# Altium project LogicBoard.PrjPcb
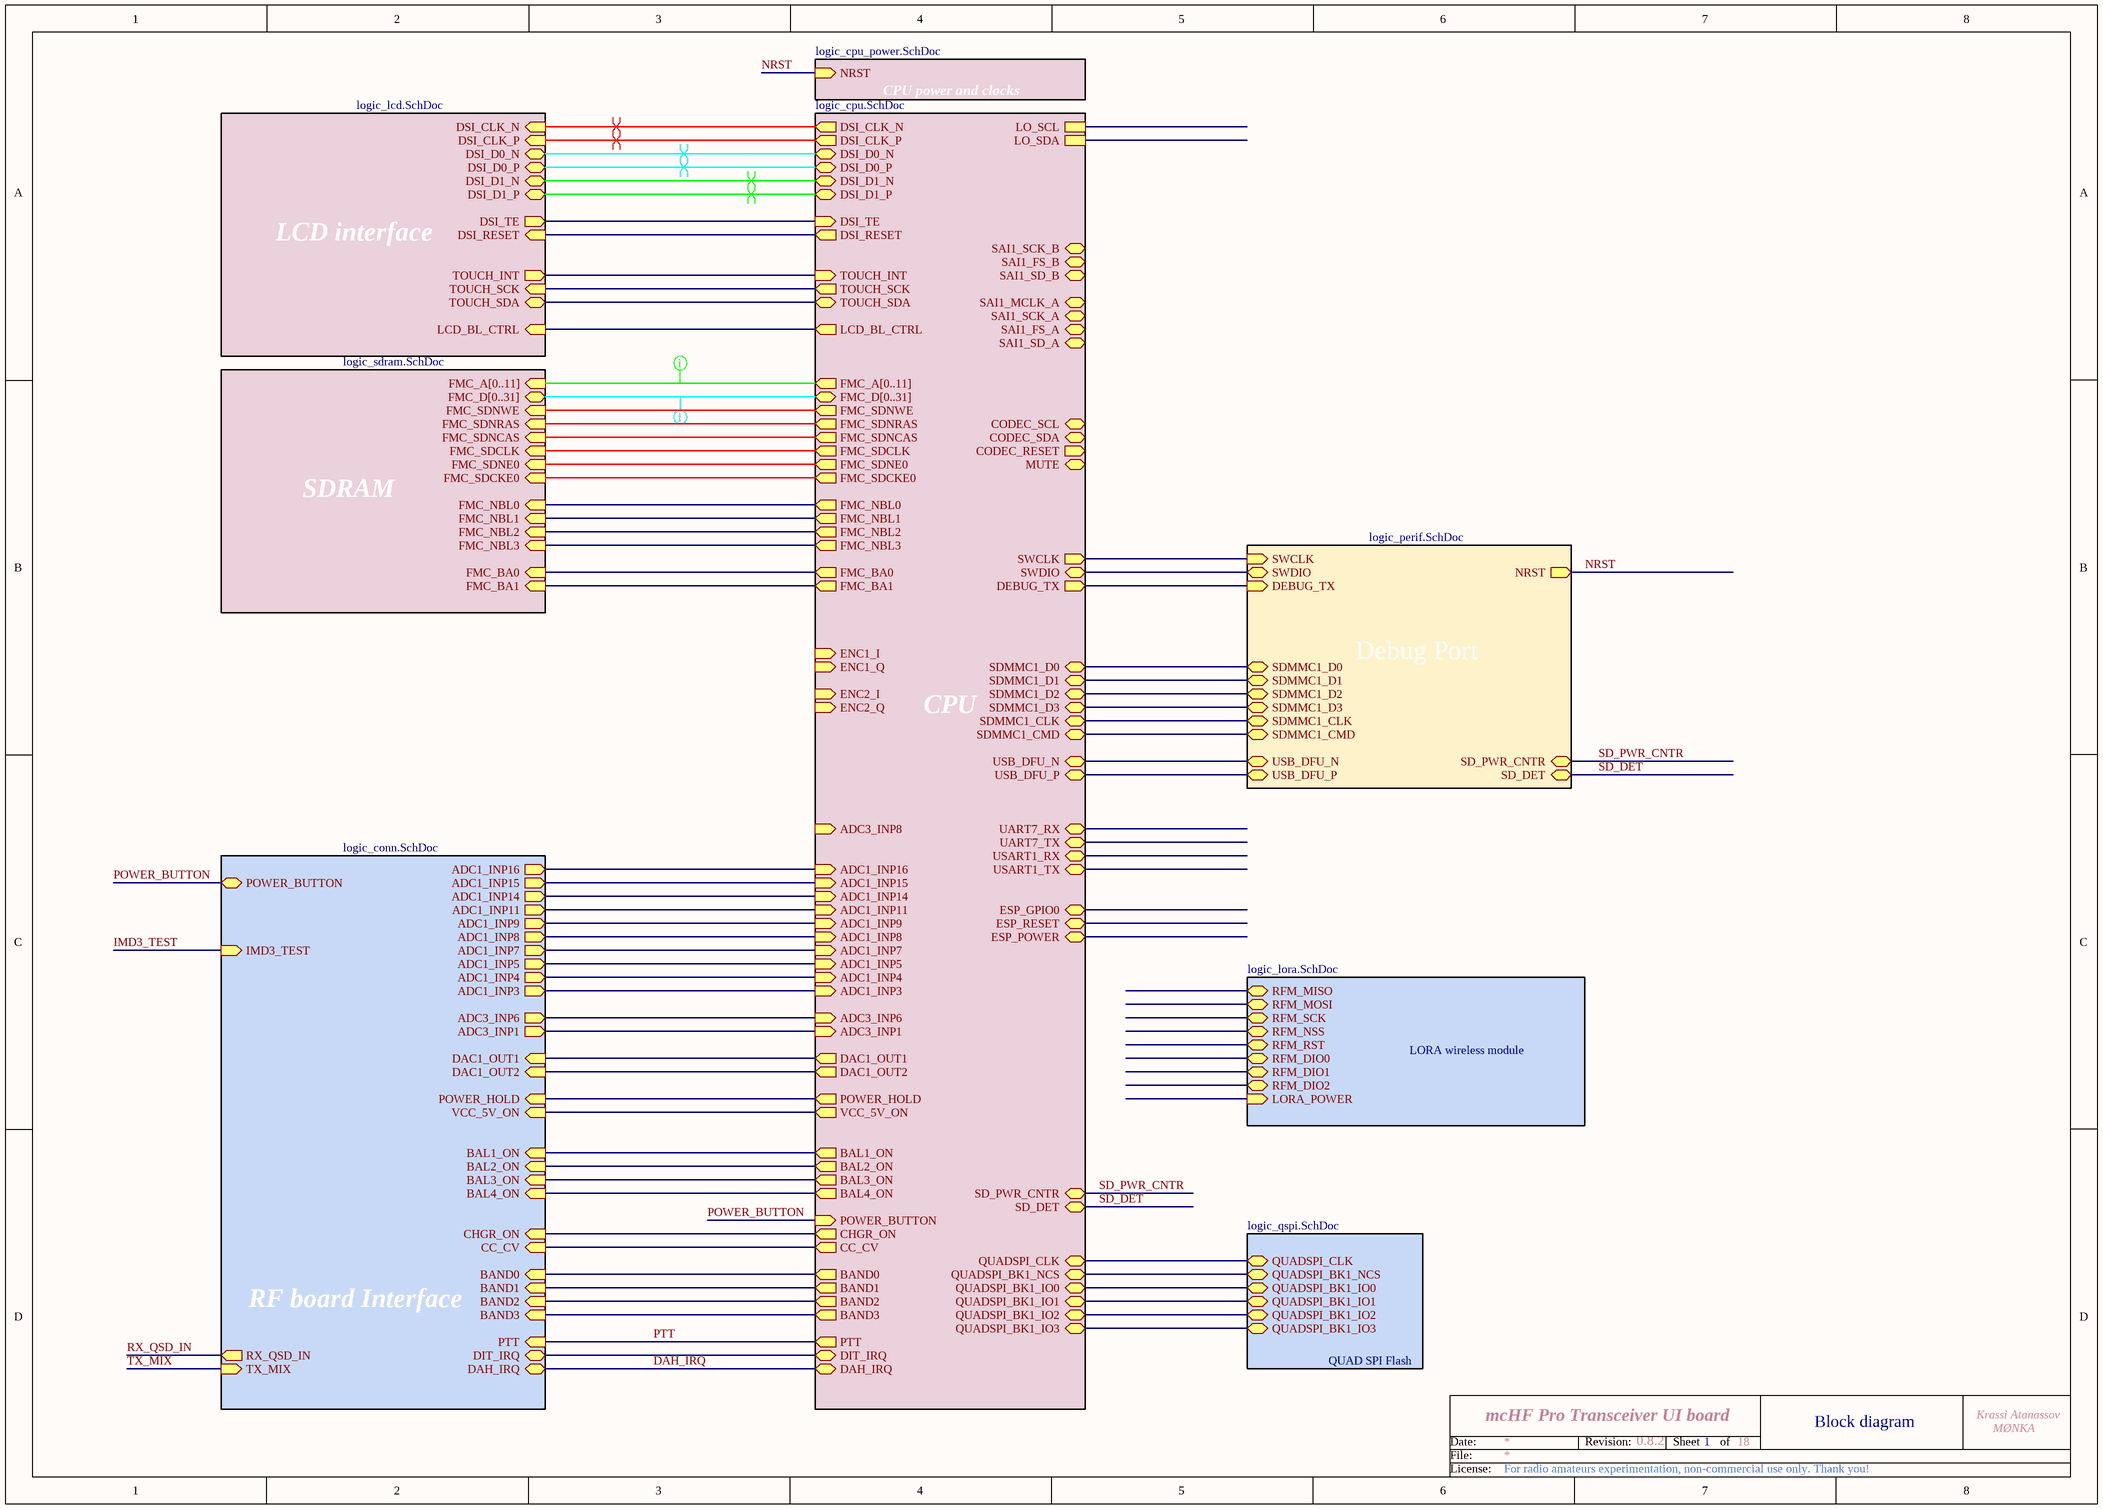
[diagram p0: logic_main.SchDoc]
4 sheets, 120 parts. Net scope: hierarchical (ports join the sheet entries above them; power ports are global).
Sheets:
  logic_main.SchDoc
    RF board Interface = logic_conn.SchDoc
    SDRAM = logic_sdram.SchDoc
    CPU power and clocks = logic_cpu_power.SchDoc

## Sheet logic_main.SchDoc: mcHF Pro Transceiver UI board
size A3; Author: Krassi Atanassov; CompanyName: MØNKA; Engineer: For radio amateurs experimentation, non-commercial use only. Thank you!; Revision: 0.8.2; SheetTotal: 18

### Sub-sheets
CPU = logic_cpu.SchDoc (file not in this document): FMC_A[0..11] (out), FMC_D[0..31] (bidir), FMC_SDNWE (out), FMC_SDNRAS (out), FMC_SDNCAS (out), FMC_SDCLK (out), FMC_BA0 (out), FMC_BA1 (out), FMC_SDNE0 (out), FMC_SDCKE0 (out), FMC_NBL0 (out), FMC_NBL1 (out), ENC1_I (in), ENC1_Q (in), ENC2_I (in), ENC2_Q (in), FMC_NBL2 (out), FMC_NBL3 (out), SWCLK (out), SWDIO (bidir), SDMMC1_D0 (bidir), SDMMC1_D1 (bidir), SDMMC1_D2 (bidir), SDMMC1_D3 (bidir), SDMMC1_CLK (bidir), SDMMC1_CMD (bidir), UART7_RX (bidir), UART7_TX (bidir), ESP_GPIO0 (bidir), ESP_RESET (bidir), ESP_POWER (bidir), DSI_CLK_N (out), DSI_CLK_P (out), DSI_D0_N (bidir), DSI_D0_P (bidir), DSI_D1_N (bidir), DSI_D1_P (bidir), LCD_BL_CTRL (out), TOUCH_INT (in), TOUCH_SCK (out), TOUCH_SDA (bidir), DSI_TE (in), DSI_RESET (out), LO_SCL, LO_SDA, ADC1_INP15 (in), ADC1_INP11 (in), ADC1_INP14 (in), ADC1_INP9 (in), ADC1_INP8 (in), ADC1_INP7 (in), ADC1_INP5 (in), ADC1_INP4 (in), ADC3_INP6 (in), ADC1_INP3 (in), ADC3_INP1 (in), POWER_HOLD (out), DAC1_OUT1 (out), DAC1_OUT2 (out), ADC1_INP16 (in), CODEC_SCL (bidir), CODEC_SDA (bidir), SAI1_SCK_B (bidir), SAI1_FS_B (bidir), SAI1_SD_B (bidir), SAI1_MCLK_A (bidir), SAI1_SCK_A (bidir), SAI1_FS_A (bidir), SAI1_SD_A (bidir), QUADSPI_CLK (bidir), QUADSPI_BK1_NCS (bidir), QUADSPI_BK1_IO0 (bidir), QUADSPI_BK1_IO1 (bidir), QUADSPI_BK1_IO3 (bidir), QUADSPI_BK1_IO2 (bidir), USART1_RX (bidir), USART1_TX (bidir), DEBUG_TX (out), VCC_5V_ON (out), BAL1_ON (out), BAL2_ON (out), BAL3_ON (out), BAND0 (out), BAND1 (out), BAND2 (out), BAND3 (out), PTT (out), DIT_IRQ (bidir), DAH_IRQ (bidir), ADC3_INP8 (in), USB_DFU_N (bidir), USB_DFU_P (bidir), CODEC_RESET (out), POWER_BUTTON (in), MUTE (bidir), BAL4_ON (out), CHGR_ON (out), CC_CV (out), SD_DET (bidir), SD_PWR_CNTR (bidir)
CPU power and clocks = logic_cpu_power.SchDoc: NRST (in)
Debug Port = logic_perif.SchDoc (file not in this document): SWCLK (in), SWDIO (bidir), NRST (out), SD_PWR_CNTR (bidir), SD_DET (bidir), DEBUG_TX (in), USB_DFU_N (bidir), USB_DFU_P (bidir), SDMMC1_D0 (bidir), SDMMC1_D1 (bidir), SDMMC1_D2 (bidir), SDMMC1_D3 (bidir), SDMMC1_CLK (bidir), SDMMC1_CMD (bidir)
LCD interface = logic_lcd.SchDoc (file not in this document): DSI_CLK_N (in), LCD_BL_CTRL (in), TOUCH_INT (out), TOUCH_SCK (in), TOUCH_SDA (bidir), DSI_CLK_P (in), DSI_D0_N (bidir), DSI_D0_P (bidir), DSI_D1_N (bidir), DSI_D1_P (bidir), DSI_TE (out), DSI_RESET (in)
LORA wireless module = logic_lora.SchDoc (file not in this document): RFM_MISO (bidir), RFM_MOSI (bidir), RFM_SCK (bidir), RFM_NSS (bidir), RFM_RST (bidir), RFM_DIO0 (bidir), LORA_POWER (in), RFM_DIO1 (bidir), RFM_DIO2 (bidir)
QUAD SPI Flash = logic_qspi.SchDoc (file not in this document): QUADSPI_CLK (bidir), QUADSPI_BK1_NCS (bidir), QUADSPI_BK1_IO0 (bidir), QUADSPI_BK1_IO1 (bidir), QUADSPI_BK1_IO3 (bidir), QUADSPI_BK1_IO2 (bidir)
RF board Interface = logic_conn.SchDoc: RX_QSD_IN (out), TX_MIX (in), ADC3_INP6 (out), ADC3_INP1 (out), POWER_HOLD (in), POWER_BUTTON (bidir), DAC1_OUT1 (in), DAC1_OUT2 (in), ADC1_INP15 (out), ADC1_INP11 (out), ADC1_INP14 (out), ADC1_INP9 (out), ADC1_INP8 (out), ADC1_INP7 (out), ADC1_INP5 (out), ADC1_INP4 (out), ADC1_INP3 (out), ADC1_INP16 (out), VCC_5V_ON (in), BAL1_ON (in), BAL2_ON (in), BAL3_ON (in), CHGR_ON (in), CC_CV (in), BAND0 (in), BAND1 (in), BAND2 (in), BAND3 (in), PTT (in), DIT_IRQ (bidir), DAH_IRQ (bidir), IMD3_TEST (in), BAL4_ON (in)
SDRAM = logic_sdram.SchDoc: FMC_A[0..11] (in), FMC_D[0..31] (bidir), FMC_SDNWE (in), FMC_SDNRAS (in), FMC_SDNCAS (in), FMC_SDCLK (in), FMC_BA0 (in), FMC_BA1 (in), FMC_NBL0 (in), FMC_NBL1 (in), FMC_SDNE0 (in), FMC_SDCKE0 (in), FMC_NBL2 (in), FMC_NBL3 (in)

### Nets
ADC1_INP3: sheet RF board Interface/ADC1_INP3, sheet CPU/ADC1_INP3
ADC1_INP4: sheet RF board Interface/ADC1_INP4, sheet CPU/ADC1_INP4
ADC1_INP5: sheet RF board Interface/ADC1_INP5, sheet CPU/ADC1_INP5
ADC1_INP7: sheet RF board Interface/ADC1_INP7, sheet CPU/ADC1_INP7
ADC1_INP8: sheet RF board Interface/ADC1_INP8, sheet CPU/ADC1_INP8
ADC1_INP9: sheet RF board Interface/ADC1_INP9, sheet CPU/ADC1_INP9
ADC1_INP11: sheet RF board Interface/ADC1_INP11, sheet CPU/ADC1_INP11
ADC1_INP14: sheet RF board Interface/ADC1_INP14, sheet CPU/ADC1_INP14
ADC1_INP15: sheet RF board Interface/ADC1_INP15, sheet CPU/ADC1_INP15
ADC1_INP16: sheet RF board Interface/ADC1_INP16, sheet CPU/ADC1_INP16
ADC3_INP1: sheet RF board Interface/ADC3_INP1, sheet CPU/ADC3_INP1
ADC3_INP6: sheet RF board Interface/ADC3_INP6, sheet CPU/ADC3_INP6
BAL1_ON: sheet RF board Interface/BAL1_ON, sheet CPU/BAL1_ON
BAL2_ON: sheet RF board Interface/BAL2_ON, sheet CPU/BAL2_ON
BAL3_ON: sheet RF board Interface/BAL3_ON, sheet CPU/BAL3_ON
BAL4_ON: sheet RF board Interface/BAL4_ON, sheet CPU/BAL4_ON
BAND0: sheet RF board Interface/BAND0, sheet CPU/BAND0
BAND1: sheet RF board Interface/BAND1, sheet CPU/BAND1
BAND2: sheet RF board Interface/BAND2, sheet CPU/BAND2
BAND3: sheet RF board Interface/BAND3, sheet CPU/BAND3
CC_CV: sheet RF board Interface/CC_CV, sheet CPU/CC_CV
CHGR_ON: sheet RF board Interface/CHGR_ON, sheet CPU/CHGR_ON
DAC1_OUT1: sheet RF board Interface/DAC1_OUT1, sheet CPU/DAC1_OUT1
DAC1_OUT2: sheet RF board Interface/DAC1_OUT2, sheet CPU/DAC1_OUT2
DAH_IRQ: sheet RF board Interface/DAH_IRQ, sheet CPU/DAH_IRQ
DIT_IRQ: sheet RF board Interface/DIT_IRQ, sheet CPU/DIT_IRQ
FMC_BA0: sheet CPU/FMC_BA0, sheet SDRAM/FMC_BA0
FMC_BA1: sheet CPU/FMC_BA1, sheet SDRAM/FMC_BA1
FMC_NBL0: sheet CPU/FMC_NBL0, sheet SDRAM/FMC_NBL0
FMC_NBL1: sheet CPU/FMC_NBL1, sheet SDRAM/FMC_NBL1
FMC_NBL2: sheet CPU/FMC_NBL2, sheet SDRAM/FMC_NBL2
FMC_NBL3: sheet CPU/FMC_NBL3, sheet SDRAM/FMC_NBL3
FMC_SDCKE0: sheet CPU/FMC_SDCKE0, sheet SDRAM/FMC_SDCKE0
FMC_SDCLK: sheet CPU/FMC_SDCLK, sheet SDRAM/FMC_SDCLK
FMC_SDNCAS: sheet CPU/FMC_SDNCAS, sheet SDRAM/FMC_SDNCAS
FMC_SDNE0: sheet CPU/FMC_SDNE0, sheet SDRAM/FMC_SDNE0
FMC_SDNRAS: sheet CPU/FMC_SDNRAS, sheet SDRAM/FMC_SDNRAS
FMC_SDNWE: sheet CPU/FMC_SDNWE, sheet SDRAM/FMC_SDNWE
NRST: sheet CPU power and clocks/NRST, sheet Debug Port/NRST
POWER_BUTTON: sheet RF board Interface/POWER_BUTTON, sheet CPU/POWER_BUTTON
PTT: sheet RF board Interface/PTT, sheet CPU/PTT
SD_DET: sheet CPU/SD_DET, sheet Debug Port/SD_DET
SD_PWR_CNTR: sheet CPU/SD_PWR_CNTR, sheet Debug Port/SD_PWR_CNTR
VCC_5V_ON: sheet RF board Interface/VCC_5V_ON, sheet CPU/VCC_5V_ON
NetD2_1: sheet RF board Interface/POWER_HOLD, sheet CPU/POWER_HOLD
(unnamed): sheet CPU/SWCLK, sheet Debug Port/SWCLK
(unnamed): sheet CPU/SWDIO, sheet Debug Port/SWDIO
(unnamed): sheet CPU/SDMMC1_D0, sheet Debug Port/SDMMC1_D0
(unnamed): sheet CPU/SDMMC1_D1, sheet Debug Port/SDMMC1_D1
(unnamed): sheet CPU/SDMMC1_D2, sheet Debug Port/SDMMC1_D2
(unnamed): sheet CPU/SDMMC1_D3, sheet Debug Port/SDMMC1_D3
(unnamed): sheet CPU/SDMMC1_CLK, sheet Debug Port/SDMMC1_CLK
(unnamed): sheet CPU/SDMMC1_CMD, sheet Debug Port/SDMMC1_CMD
(unnamed): sheet CPU/DSI_CLK_N, sheet LCD interface/DSI_CLK_N
(unnamed): sheet CPU/DSI_CLK_P, sheet LCD interface/DSI_CLK_P
(unnamed): sheet CPU/DSI_D0_N, sheet LCD interface/DSI_D0_N
(unnamed): sheet CPU/DSI_D0_P, sheet LCD interface/DSI_D0_P
(unnamed): sheet CPU/DSI_D1_N, sheet LCD interface/DSI_D1_N
(unnamed): sheet CPU/DSI_D1_P, sheet LCD interface/DSI_D1_P
(unnamed): sheet CPU/LCD_BL_CTRL, sheet LCD interface/LCD_BL_CTRL
(unnamed): sheet CPU/TOUCH_INT, sheet LCD interface/TOUCH_INT
(unnamed): sheet CPU/TOUCH_SCK, sheet LCD interface/TOUCH_SCK
(unnamed): sheet CPU/TOUCH_SDA, sheet LCD interface/TOUCH_SDA
(unnamed): sheet CPU/DSI_TE, sheet LCD interface/DSI_TE
(unnamed): sheet CPU/DSI_RESET, sheet LCD interface/DSI_RESET
(unnamed): sheet CPU/QUADSPI_CLK, sheet QUAD SPI Flash/QUADSPI_CLK
(unnamed): sheet CPU/QUADSPI_BK1_NCS, sheet QUAD SPI Flash/QUADSPI_BK1_NCS
(unnamed): sheet CPU/QUADSPI_BK1_IO0, sheet QUAD SPI Flash/QUADSPI_BK1_IO0
(unnamed): sheet CPU/QUADSPI_BK1_IO1, sheet QUAD SPI Flash/QUADSPI_BK1_IO1
(unnamed): sheet CPU/QUADSPI_BK1_IO3, sheet QUAD SPI Flash/QUADSPI_BK1_IO3
(unnamed): sheet CPU/QUADSPI_BK1_IO2, sheet QUAD SPI Flash/QUADSPI_BK1_IO2
(unnamed): sheet CPU/DEBUG_TX, sheet Debug Port/DEBUG_TX
(unnamed): sheet CPU/USB_DFU_N, sheet Debug Port/USB_DFU_N
(unnamed): sheet CPU/USB_DFU_P, sheet Debug Port/USB_DFU_P

### Buses and harness runs
bus sheet CPU/FMC_A[0..11] = sheet SDRAM/FMC_A[0..11]
bus sheet CPU/FMC_D[0..31] = sheet SDRAM/FMC_D[0..31]

### Layout directives
differential pair: (no net found under the mark)
rule Matched Net Lengths [Tolerance = 100mil]: (no net found under the mark)

### Notes on the sheet
- 1
- Block diagram
- Date:
- File:
- Revision:
- Sheet
- of
- License:

## Sheet logic_conn.SchDoc: mcHF Pro Transceiver UI board
size A3; Author: Krassi Atanassov; CompanyName: MØNKA; Engineer: For radio amateurs experimentation, non-commercial use only. Thank you!; Revision: 0.8.2; SheetTotal: 18
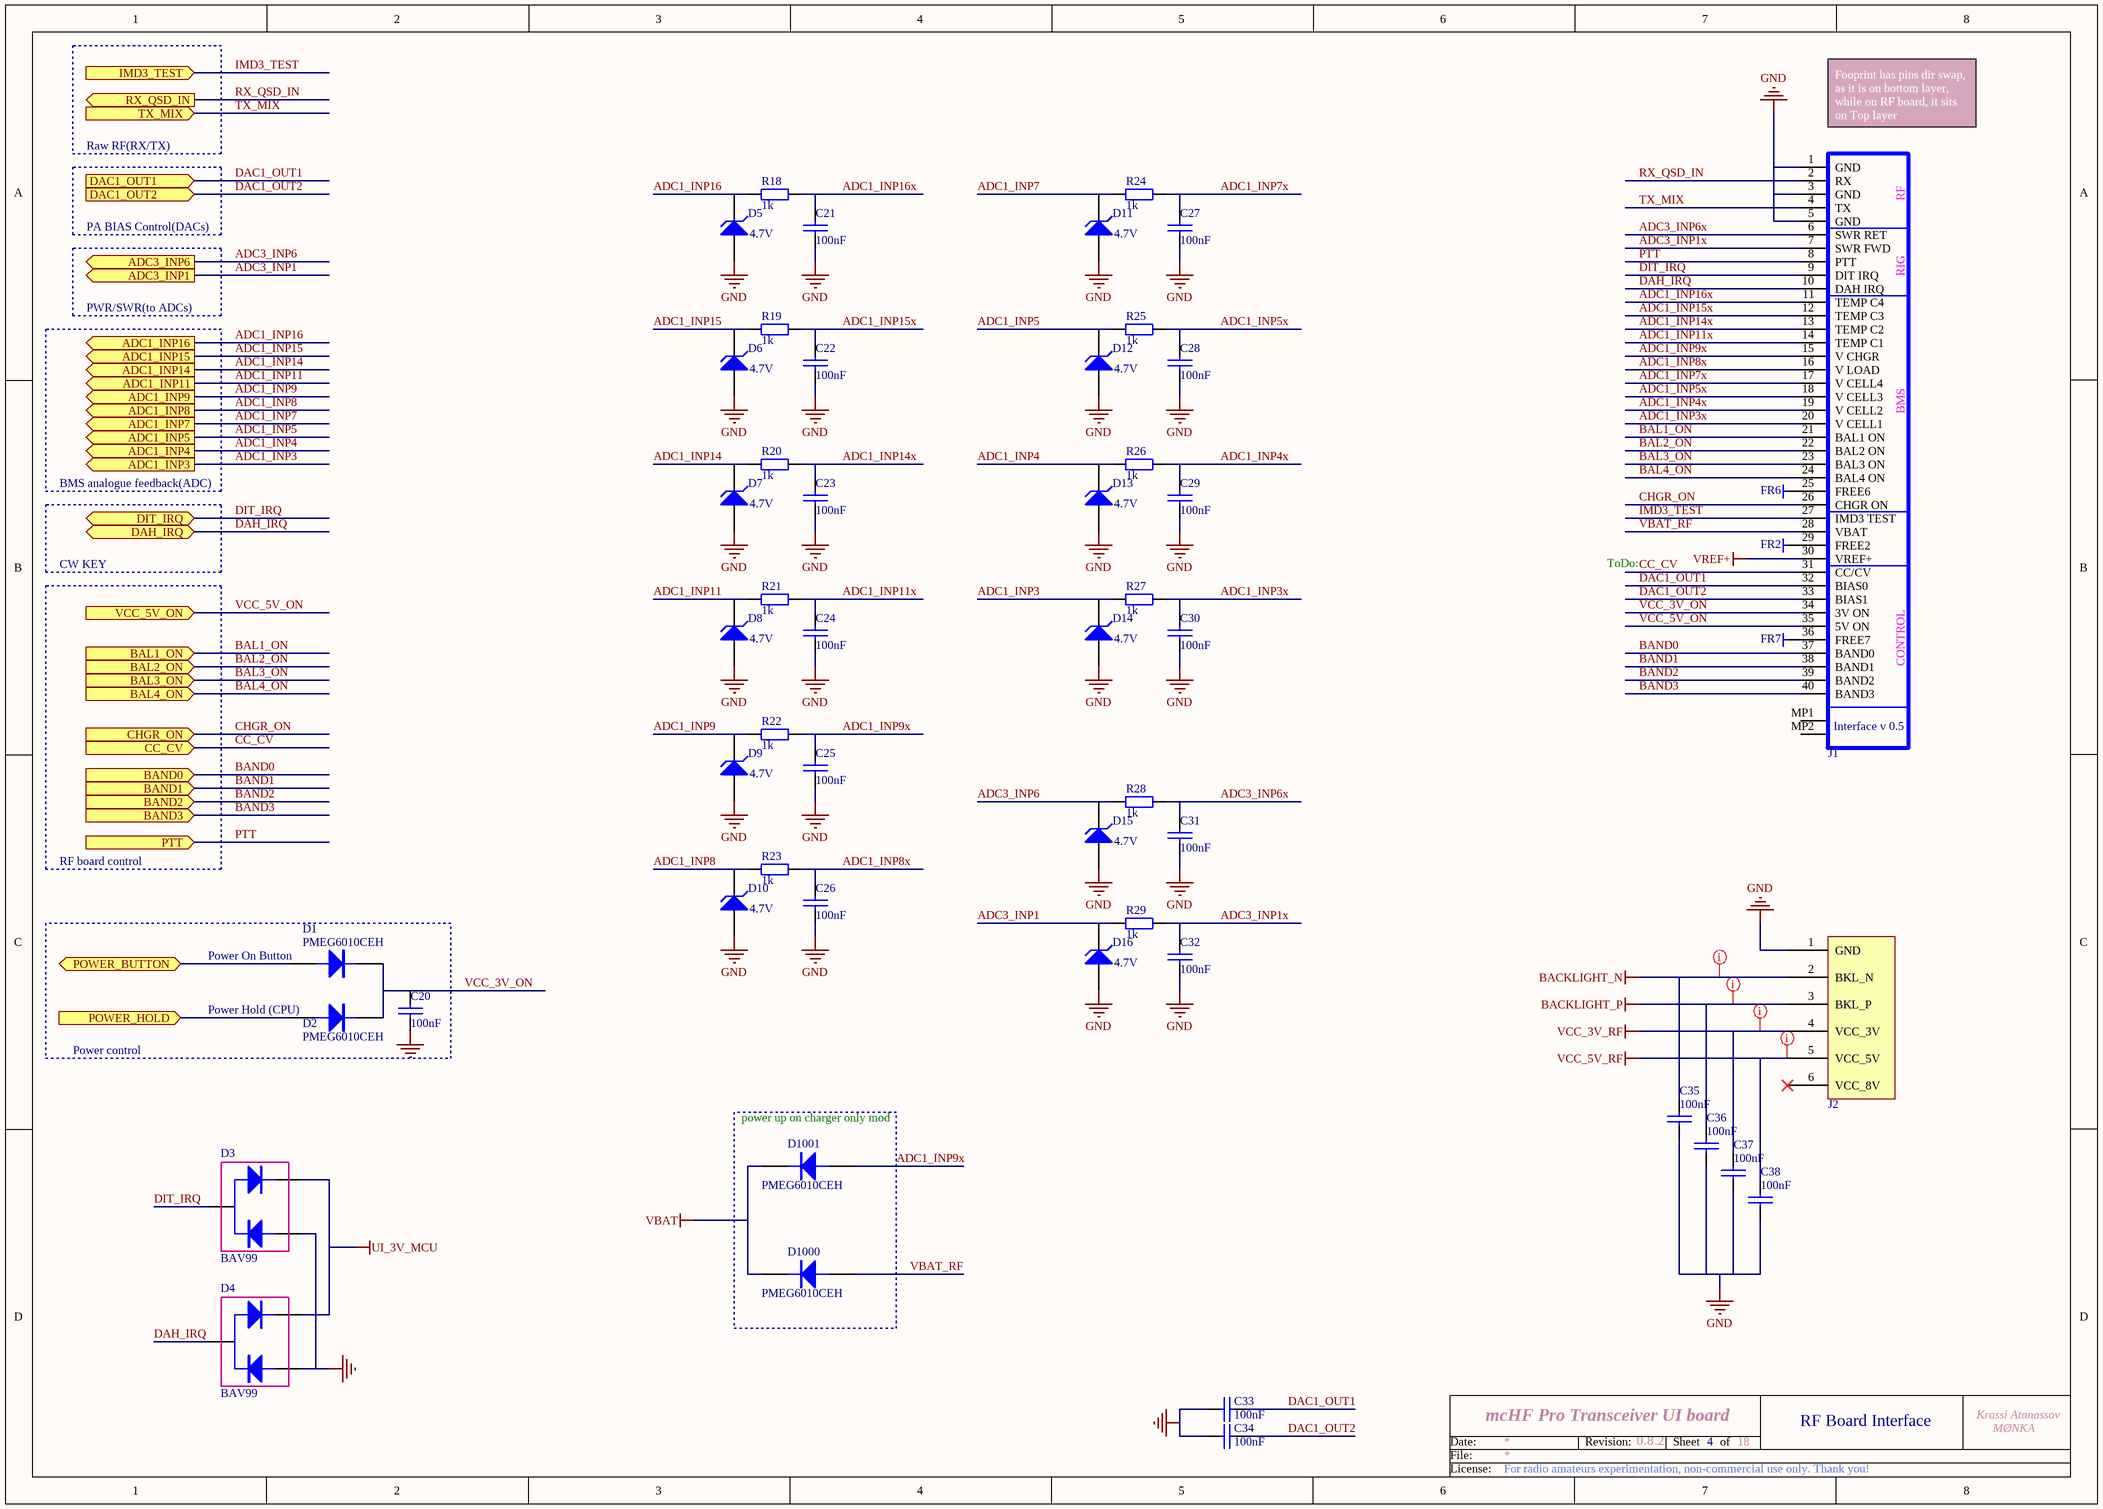
[diagram p1: logic_conn.SchDoc]

### Parts
C20  100nF  [0805]
C21  100nF  [0805]
C22  100nF  [0805]
C23  100nF  [0805]
C24  100nF  [0805]
C25  100nF  [0805]
C26  100nF  [0805]
C27  100nF  [0805]
C28  100nF  [0805]
C29  100nF  [0805]
C30  100nF  [0805]
C31  100nF  [0805]
C32  100nF  [0805]
C33  100nF  [0805]
C34  100nF  [0805]
C35  100nF  [0805]
C36  100nF  [0805]
C37  100nF  [0805]
C38  100nF  [0805]
D1  PMEG6010CEH  [SOD87]
D2  PMEG6010CEH  [SOD87]
D3  BAV99  [SOT-23]
D4  BAV99  [SOT-23]
D5  4.7V  [0805P]
D6  4.7V  [0805P]
D7  4.7V  [0805P]
D8  4.7V  [0805P]
D9  4.7V  [0805P]
D10  4.7V  [0805P]
D11  4.7V  [0805P]
D12  4.7V  [0805P]
D13  4.7V  [0805P]
D14  4.7V  [0805P]
D15  4.7V  [0805P]
D16  4.7V  [0805P]
D1000  PMEG6010CEH  [SOD87]
D1001  PMEG6010CEH  [SOD87]
FR2  TP  [tp]  (value not drawn)  (no BOM)
FR6  TP  [tp]  (value not drawn)  (no BOM)
FR7  TP  [tp]  (value not drawn)  (no BOM)
J1  INT V 0.5  [MOLX-54132-4033r]  (value not drawn)
J2  PWR6  [HDR_1x6_PWR_R]  (value not drawn)
R18  1k  [0805]
R19  1k  [0805]
R20  1k  [0805]
R21  1k  [0805]
R22  1k  [0805]
R23  1k  [0805]
R24  1k  [0805]
R25  1k  [0805]
R26  1k  [0805]
R27  1k  [0805]
R28  1k  [0805]
R29  1k  [0805]

### Blocks framed on the sheet
power up on charger only mod: D1000 D1001

### Ports
ADC1_INP3 (out), ADC1_INP4 (out), ADC1_INP5 (out), ADC1_INP7 (out), ADC1_INP8 (out), ADC1_INP9 (out), ADC1_INP11 (out), ADC1_INP14 (out), ADC1_INP15 (out), ADC1_INP16 (out), ADC3_INP1 (out), ADC3_INP6 (out), BAL1_ON (in), BAL2_ON (in), BAL3_ON (in), BAL4_ON (in), BAND0 (in), BAND1 (in), BAND2 (in), BAND3 (in), CC_CV (in), CHGR_ON (in), DAC1_OUT1 (in), DAC1_OUT2 (in), DAH_IRQ (bidir), DIT_IRQ (bidir), IMD3_TEST (in), POWER_BUTTON (bidir), POWER_HOLD (in), PTT (in), RX_QSD_IN (out), TX_MIX (in), VCC_5V_ON (in)

### Nets
BACKLIGHT_N: C35.2 J2.2(BKL_N)
BACKLIGHT_P: C36.2 J2.3(BKL_P)
GND: C20.1 C21.1 C22.1 C23.1 C24.1 C25.1 C26.1 C27.1 C28.1 C29.1 C30.1 C31.1 C32.1 C33.2 C34.2 C35.1 C36.1 C37.1 C38.1 D3.1(A1) D4.1(A1) D5.1(A) D6.1(A) D7.1(A) D8.1(A) D9.1(A) D10.1(A) D11.1(A) D12.1(A) D13.1(A) D14.1(A) D15.1(A) D16.1(A) J1.1(GND) J1.3(GND) J1.5(GND) J2.1(GND)
UI_3V_MCU: D3.2(K1) D4.2(K1)
VBAT: D1000.2(K) D1001.2(K)
VCC_3V_RF: C37.2 J2.4(VCC_3V)
VCC_5V_RF: C38.2 J2.5(VCC_5V)
VREF+: J1.30(VREF+)
ADC1_INP3: D14.2(K) R27.2 ; port ADC1_INP3
ADC1_INP3x: C30.2 J1.20(V_CELL1) R27.1
ADC1_INP4: D13.2(K) R26.2 ; port ADC1_INP4
ADC1_INP4x: C29.2 J1.19(V_CELL2) R26.1
ADC1_INP5: D12.2(K) R25.2 ; port ADC1_INP5
ADC1_INP5x: C28.2 J1.18(V_CELL3) R25.1
ADC1_INP7: D11.2(K) R24.2 ; port ADC1_INP7
ADC1_INP7x: C27.2 J1.17(V_CELL4) R24.1
ADC1_INP8: D10.2(K) R23.2 ; port ADC1_INP8
ADC1_INP8x: C26.2 J1.16(V_LOAD) R23.1
ADC1_INP9: D9.2(K) R22.2 ; port ADC1_INP9
ADC1_INP9x: C25.2 D1001.1(A) J1.15(V_CHGR) R22.1
ADC1_INP11: D8.2(K) R21.2 ; port ADC1_INP11
ADC1_INP11x: C24.2 J1.14(TEMP_C1) R21.1
ADC1_INP14: D7.2(K) R20.2 ; port ADC1_INP14
ADC1_INP14x: C23.2 J1.13(TEMP_C2) R20.1
ADC1_INP15: D6.2(K) R19.2 ; port ADC1_INP15
ADC1_INP15x: C22.2 J1.12(TEMP_C3) R19.1
ADC1_INP16: D5.2(K) R18.2 ; port ADC1_INP16
ADC1_INP16x: C21.2 J1.11(TEMP_C4) R18.1
ADC3_INP1: D16.2(K) R29.2 ; port ADC3_INP1
ADC3_INP1x: C32.2 J1.7(SWR_FWD) R29.1
ADC3_INP6: D15.2(K) R28.2 ; port ADC3_INP6
ADC3_INP6x: C31.2 J1.6(SWR_RET) R28.1
BAL1_ON: J1.21(BAL1_ON) ; port BAL1_ON
BAL2_ON: J1.22(BAL2_ON) ; port BAL2_ON
BAL3_ON: J1.23(BAL3_ON) ; port BAL3_ON
BAL4_ON: J1.24(BAL4_ON) ; port BAL4_ON
BAND0: J1.37(BAND0) ; port BAND0
BAND1: J1.38(BAND1) ; port BAND1
BAND2: J1.39(BAND2) ; port BAND2
BAND3: J1.40(BAND3) ; port BAND3
CC_CV: J1.31(CC/CV) ; port CC_CV
CHGR_ON: J1.26(CHGR_ON) ; port CHGR_ON
DAC1_OUT1: C33.1 J1.32(BIAS0) ; port DAC1_OUT1
DAC1_OUT2: C34.1 J1.33(BIAS1) ; port DAC1_OUT2
DAH_IRQ: D4.3(C) J1.10(DAH_IRQ) ; port DAH_IRQ
DIT_IRQ: D3.3(C) J1.9(DIT_IRQ) ; port DIT_IRQ
IMD3_TEST: J1.27(IMD3_TEST) ; port IMD3_TEST
POWER_BUTTON: D1.1(A) ; port POWER_BUTTON
PTT: J1.8(PTT) ; port PTT
RX_QSD_IN: J1.2(RX) ; port RX_QSD_IN
TX_MIX: J1.4(TX) ; port TX_MIX
VBAT_RF: D1000.1(A) J1.28(VBAT)
VCC_3V_ON: C20.2 D1.2(K) D2.2(K) J1.34(3V_ON)
VCC_5V_ON: J1.35(5V_ON) ; port VCC_5V_ON
NetD2_1: D2.1(A) ; port POWER_HOLD
NetFR2_1: FR2.1 J1.29(FREE2)
NetFR6_1: FR6.1 J1.25(FREE6)
NetFR7_1: FR7.1 J1.36(FREE7)

Not connected (* = marked no-connect by the designer): J1 MP1 MP2; J2 6(VCC_8V)*

### Layout directives
rule Width Constraint [Pref Width = 12mil    Min Width = 12mil    Max Width = 12mil]: BACKLIGHT_N, BACKLIGHT_P, VCC_3V_RF, VCC_5V_RF

### Notes on the sheet
- Raw RF(RX/TX)
- (near J1) Fooprint has pins dir swap, as it is on bottom layer, while on RF board, it sits on Top layer
- PA BIAS Control(DACs)
- PWR/SWR(to ADCs)
- BMS analogue feedback(ADC)
- CW KEY
- ToDo:
- RF board control
- (near D1) Power On Button
- Power control
- (near D2) Power Hold (CPU)
- 4
- RF Board Interface
- Date:
- File:
- Revision:
- Sheet
- of
- License:
- (in symbol PCB40_FLAT) RF; RIG; BMS; CONTROL; Interface v 0.5

### Library data of the parts
C20-C38 = CAP: Capacitor; Order: FN 252-2090; QT Order: QCC-00154; Price: 0.068
D1 D2 D1000 D1001 = PMEG6010CEH: DIODE, SCHOTTKY, 1A, 60V, SOD-123F; QT Order: QCD-00034; Price: 0.085
D3 = BAV99: Small Signal Diode, Dual Series; Order: FN 162-1837; QT Order: QCD-00039; Price: 0.0618
D4 = BAV99: Small Signal Diode, Dual Series; Order: FN 162-1837; Price: 0.0618
D5 = D Zener: Zener Diode; Notes: Generic 2pin zener in 0805V; Voltage: 4.5V - 5V; Published: 8-Jun-2000; LatestRevisionDate: 17-Jul-2002; LatestRevisionNote: Re-released for DXP Platform.; PackageReference: DIODE-0.7; Publisher: Altium Limited; PackageDescription: Diode, Thru-Hole; 2 Leads; 0.7 in Pin Spacing
D6-D16 = D Zener: Zener Diode; Published: 8-Jun-2000; LatestRevisionDate: 17-Jul-2002; LatestRevisionNote: Re-released for DXP Platform.; PackageReference: DIODE-0.7; Publisher: Altium Limited; PackageDescription: Diode, Thru-Hole; 2 Leads; 0.7 in Pin Spacing
FR2 FR6 FR7 = TP: Test point
J1 = PCB40_FLAT: 40 pin FPC Flat cable connector, board to board
J2 = PWR6: Power connector; Notes: Japan style 6pin 2.54mm pitch, right angle PCB connector
R18-R29 = RES: Resistor; Order: FN 146-9899; QT Order: QCR-00309; Price: 0.023

## Sheet logic_sdram.SchDoc: mcHF Pro Transceiver UI board
size A3; Author: Krassi Atanassov; CompanyName: MØNKA; Engineer: For radio amateurs experimentation, non-commercial use only. Thank you!; Revision: 0.8.2; SheetTotal: 18
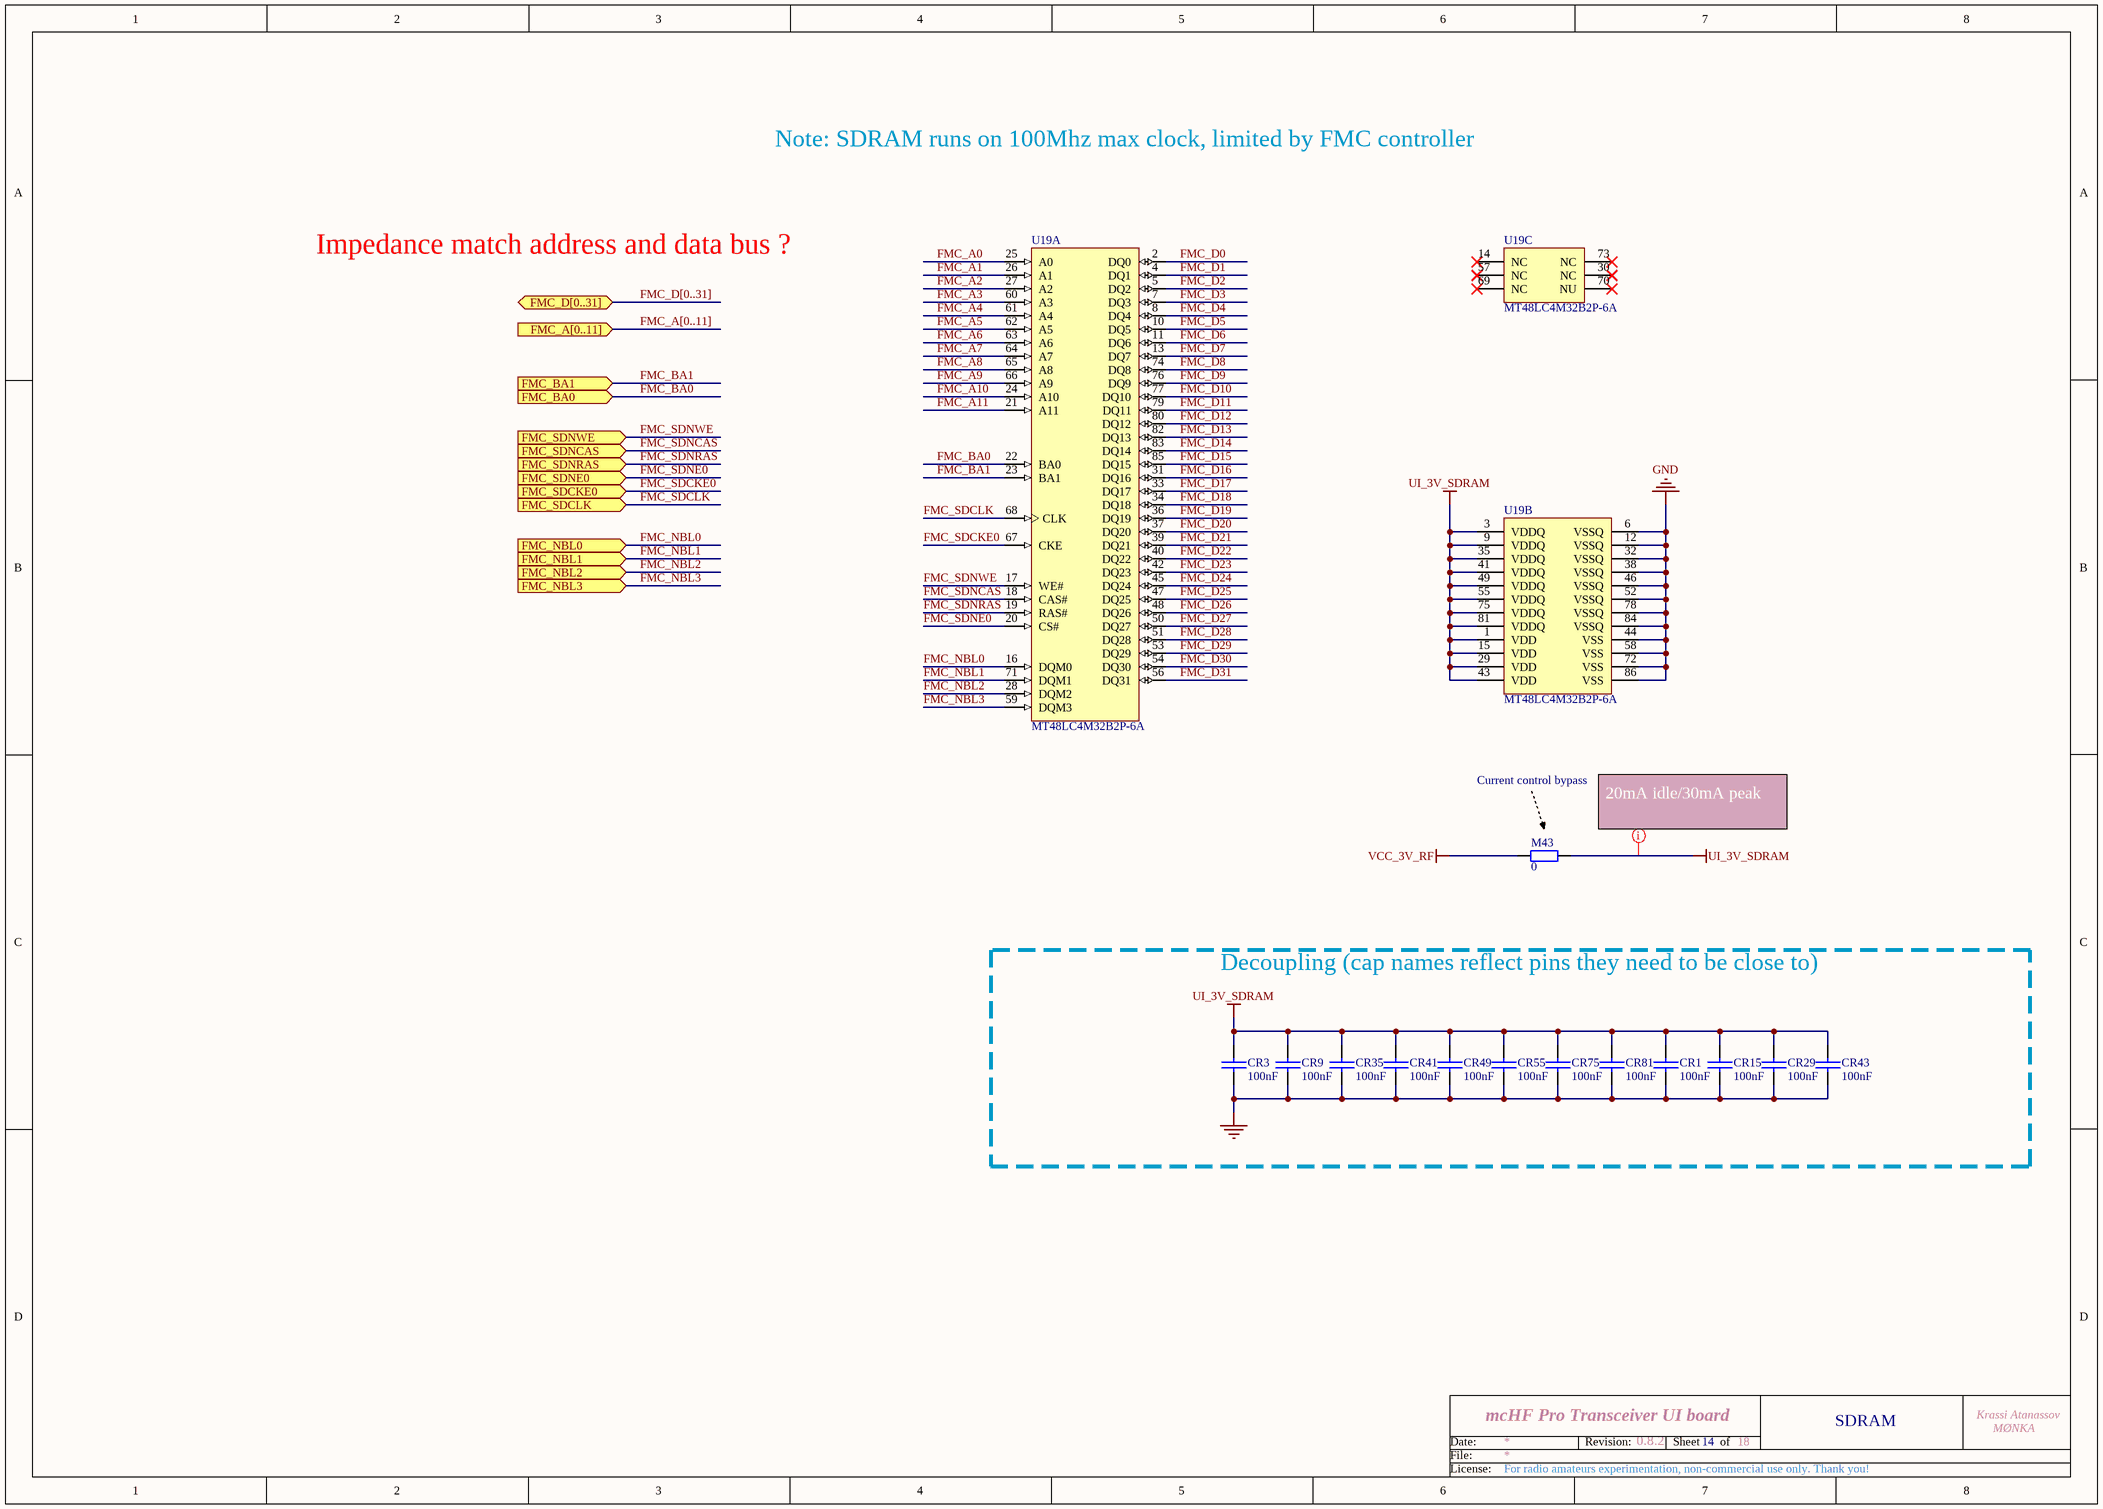
[diagram p2: logic_sdram.SchDoc]

### Parts
CR1  100nF  [0805]
CR3  100nF  [0805]
CR9  100nF  [0805]
CR15  100nF  [0805]
CR29  100nF  [0805]
CR35  100nF  [0805]
CR41  100nF  [0805]
CR43  100nF  [0805]
CR49  100nF  [0805]
CR55  100nF  [0805]
CR75  100nF  [0805]
CR81  100nF  [0805]
M43  0  [0805]
U19  MT48LC4M32B2P-6A  [MICT-TG-86_N]  (parts A,B,C of 3)

### Blocks framed on the sheet
Decoupling (cap names reflect pins they need to be close to): CR1 CR3 CR9 CR15 CR29 CR35 CR41 CR43 CR49 CR55 CR75 CR81

### Ports
FMC_A[0..11] (in), FMC_BA0 (in), FMC_BA1 (in), FMC_D[0..31] (bidir), FMC_NBL0 (in), FMC_NBL1 (in), FMC_NBL2 (in), FMC_NBL3 (in), FMC_SDCKE0 (in), FMC_SDCLK (in), FMC_SDNCAS (in), FMC_SDNE0 (in), FMC_SDNRAS (in), FMC_SDNWE (in)

### Nets
GND: CR1.2 CR3.2 CR9.2 CR15.2 CR29.2 CR35.2 CR41.2 CR43.2 CR49.2 CR55.2 CR75.2 CR81.2 U19.6(VSSQ) U19.12(VSSQ) U19.32(VSSQ) U19.38(VSSQ) U19.44(VSS) U19.46(VSSQ) U19.52(VSSQ) U19.58(VSS) U19.72(VSS) U19.78(VSSQ) U19.84(VSSQ) U19.86(VSS)
UI_3V_SDRAM: CR1.1 CR3.1 CR9.1 CR15.1 CR29.1 CR35.1 CR41.1 CR43.1 CR49.1 CR55.1 CR75.1 CR81.1 M43.2 U19.1(VDD) U19.3(VDDQ) U19.9(VDDQ) U19.15(VDD) U19.29(VDD) U19.35(VDDQ) U19.41(VDDQ) U19.43(VDD) U19.49(VDDQ) U19.55(VDDQ) U19.75(VDDQ) U19.81(VDDQ)
VCC_3V_RF: M43.1
FMC_A0: U19.25(A0)
FMC_A1: U19.26(A1)
FMC_A2: U19.27(A2)
FMC_A3: U19.60(A3)
FMC_A4: U19.61(A4)
FMC_A5: U19.62(A5)
FMC_A6: U19.63(A6)
FMC_A7: U19.64(A7)
FMC_A8: U19.65(A8)
FMC_A9: U19.66(A9)
FMC_A10: U19.24(A10)
FMC_A11: U19.21(A11)
FMC_BA0: U19.22(BA0) ; port FMC_BA0
FMC_BA1: U19.23(BA1) ; port FMC_BA1
FMC_D0: U19.2(DQ0)
FMC_D1: U19.4(DQ1)
FMC_D2: U19.5(DQ2)
FMC_D3: U19.7(DQ3)
FMC_D4: U19.8(DQ4)
FMC_D5: U19.10(DQ5)
FMC_D6: U19.11(DQ6)
FMC_D7: U19.13(DQ7)
FMC_D8: U19.74(DQ8)
FMC_D9: U19.76(DQ9)
FMC_D10: U19.77(DQ10)
FMC_D11: U19.79(DQ11)
FMC_D12: U19.80(DQ12)
FMC_D13: U19.82(DQ13)
FMC_D14: U19.83(DQ14)
FMC_D15: U19.85(DQ15)
FMC_D16: U19.31(DQ16)
FMC_D17: U19.33(DQ17)
FMC_D18: U19.34(DQ18)
FMC_D19: U19.36(DQ19)
FMC_D20: U19.37(DQ20)
FMC_D21: U19.39(DQ21)
FMC_D22: U19.40(DQ22)
FMC_D23: U19.42(DQ23)
FMC_D24: U19.45(DQ24)
FMC_D25: U19.47(DQ25)
FMC_D26: U19.48(DQ26)
FMC_D27: U19.50(DQ27)
FMC_D28: U19.51(DQ28)
FMC_D29: U19.53(DQ29)
FMC_D30: U19.54(DQ30)
FMC_D31: U19.56(DQ31)
FMC_NBL0: U19.16(DQM0) ; port FMC_NBL0
FMC_NBL1: U19.71(DQM1) ; port FMC_NBL1
FMC_NBL2: U19.28(DQM2) ; port FMC_NBL2
FMC_NBL3: U19.59(DQM3) ; port FMC_NBL3
FMC_SDCKE0: U19.67(CKE) ; port FMC_SDCKE0
FMC_SDCLK: U19.68(CLK) ; port FMC_SDCLK
FMC_SDNCAS: U19.18(CAS#) ; port FMC_SDNCAS
FMC_SDNE0: U19.20(CS#) ; port FMC_SDNE0
FMC_SDNRAS: U19.19(RAS#) ; port FMC_SDNRAS
FMC_SDNWE: U19.17(WE#) ; port FMC_SDNWE

Not connected (* = marked no-connect by the designer): U19 14(NC)* 30(NC)* 57(NC)* 69(NC)* 70(NU)* 73(NC)*

### Buses and harness runs
bus FMC_A[0..11] = port FMC_A[0..11]
bus FMC_D[0..31] = port FMC_D[0..31]

### Layout directives
rule Width Constraint [Pref Width = 12mil    Min Width = 12mil    Max Width = 12mil]: UI_3V_SDRAM

### Notes on the sheet
- Note: SDRAM runs on 100Mhz max clock, limited by FMC controller
- Impedance match address and data bus ?
- Current control bypass
- (near M43) 20mA idle/30mA peak
- 14
- SDRAM
- Date:
- File:
- Revision:
- Sheet
- of
- License:

### Library data of the parts
CR1 CR3 CR9 CR15 CR29 CR35 CR41 CR43 CR49 CR55 CR75 CR81 = CAP: Capacitor; Order: FN 282-1264; QT Order: QCC-00157; Price: 0.089
M43 = RES: Resistor; Order: FN 933-3681; QT Order: QCR-00268; Price: 0.009
U19 = MT48LC4M32B2P-6A: 128Mb PC133 SDR SDRAM, 4Mb x 32, 6ns, 3.3V, 0 to 70 degC, 86-Pin TSOP; Order: FN 225-3746; Price: 8.55

## Sheet logic_cpu_power.SchDoc: mcHF Pro Transceiver UI board
size A3; Author: Krassi Atanassov; CompanyName: MØNKA; Engineer: For radio amateurs experimentation, non-commercial use only. Thank you!; Revision: 0.8.2; SheetTotal: 18
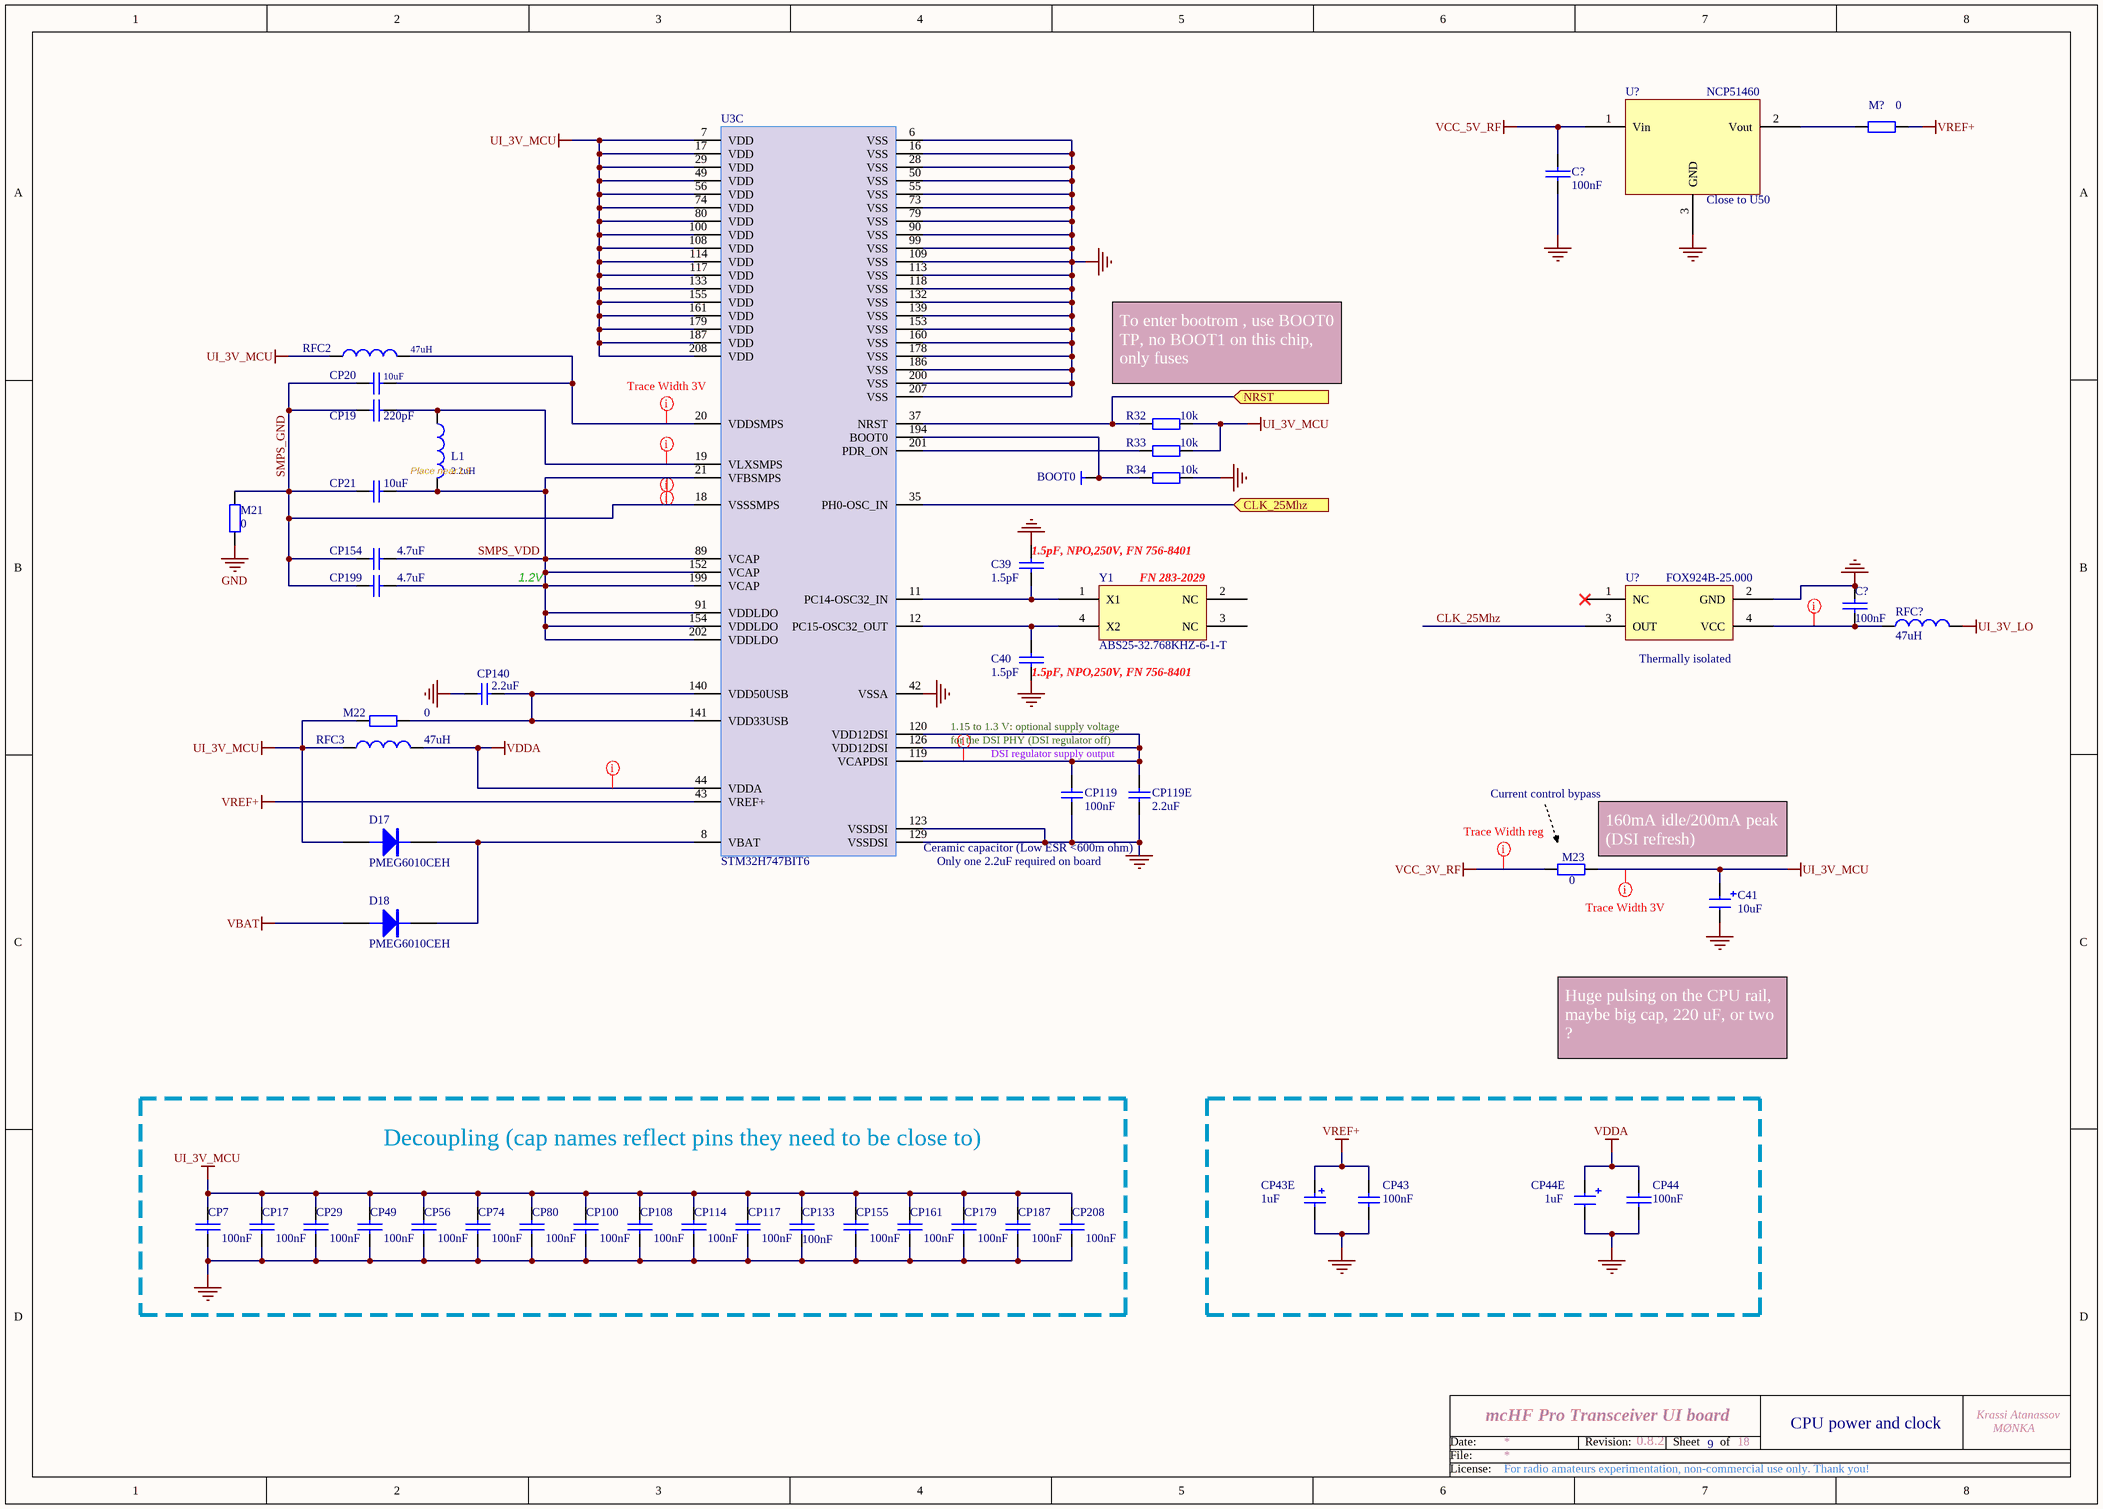
[diagram p3: logic_cpu_power.SchDoc]

### Parts
(Parts that share a designator on the sheet are numbered #1, #2 ... from top to bottom, then left to right.)
BOOT0  TP  [tp]  (value not drawn)  (no BOM)
C39  1.5pF  [0805]
C40  1.5pF  [0805]
C41  10uF  [1206_Elec_Cap]
C?#1  100nF  [0805]
C?#2  100nF  [0805]
CP7  100nF  [0805]
CP17  100nF  [0805]
CP19  220pF  [0805]
CP20  10uF  [0805]
CP21  10uF  [0805]
CP29  100nF  [0805]
CP43  100nF  [0805]
CP43E  1uF  [1206_Elec_Cap]
CP44  100nF  [0805]
CP44E  1uF  [1206_Elec_Cap]
CP49  100nF  [0805]
CP56  100nF  [0805]
CP74  100nF  [0805]
CP80  100nF  [0805]
CP100  100nF  [0805]
CP108  100nF  [0805]
CP114  100nF  [0805]
CP117  100nF  [0805]
CP119  100nF  [0805]
CP119E  2.2uF  [0805]
CP133  100nF  [0805]
CP140  2.2uF  [0805]
CP154  4.7uF  [0805]
CP155  100nF  [0805]
CP161  100nF  [0805]
CP179  100nF  [0805]
CP187  100nF  [0805]
CP199  4.7uF  [0805]
CP208  100nF  [0805]
D17  PMEG6010CEH  [SOD87]
D18  PMEG6010CEH  [SOD87]
L1  2.2uH  [0805]
M21  0  [0805]
M22  0  [0805]
M23  0  [0805]
M?  0  [0805]
R32  10k  [0805]
R33  10k  [0805]
R34  10k  [0805]
RFC2  47uH  [0805]
RFC3  47uH  [0805]
RFC?  47uH  [0805]
U3  STM32H747BIT6  [LQFP208-28x28x1.4]  (part C of 3)
U?#1  NCP51460  [SOT-23]
U?#2  FOX924B-25.000  [2SMX-3SMXB]
Y1  ABS25-32.768KHZ-6-1-T  [DSO-N4]

### Blocks framed on the sheet
Decoupling (cap names reflect pins they need to be close to): CP7 CP17 CP29 CP49 CP56 CP74 CP80 CP100 CP108 CP114 CP117 CP133 CP155 CP161 CP179 CP187 CP208

### Ports
CLK_25Mhz (in), NRST (in)

### Nets
GND: C39.2 C40.1 C41.2 C?#1.2 C?#2.1 CP7.2 CP17.2 CP29.2 CP43.1 CP43E.2 CP44.2 CP44E.2 CP49.2 CP56.2 CP74.2 CP80.2 CP100.2 CP108.2 CP114.2 CP117.2 CP119.2 CP119E.2 CP133.2 CP140.2 CP155.2 CP161.2 CP179.2 CP187.2 CP208.2 M21.2 R34.1 U3.6(VSS) U3.16(VSS) U3.28(VSS) U3.42(VSSA) U3.50(VSS) U3.55(VSS) U3.73(VSS) U3.79(VSS) U3.90(VSS) U3.99(VSS) U3.109(VSS) U3.113(VSS) U3.118(VSS) U3.123(VSSDSI) U3.129(VSSDSI) U3.132(VSS) U3.139(VSS) U3.153(VSS) U3.160(VSS) U3.178(VSS) U3.186(VSS) U3.200(VSS) U3.207(VSS) U?#1.3(GND) U?#2.2(GND)
UI_3V_LO: RFC?.2
UI_3V_MCU: C41.1 CP7.1 CP17.1 CP29.1 CP49.1 CP56.1 CP74.1 CP80.1 CP100.1 CP108.1 CP114.1 CP117.1 CP133.1 CP155.1 CP161.1 CP179.1 CP187.1 CP208.1 D17.1(A) M22.2 M23.1 R32.1 R33.1 RFC2.1 RFC3.1 U3.7(VDD) U3.17(VDD) U3.29(VDD) U3.49(VDD) U3.56(VDD) U3.74(VDD) U3.80(VDD) U3.100(VDD) U3.108(VDD) U3.114(VDD) U3.117(VDD) U3.133(VDD) U3.155(VDD) U3.161(VDD) U3.179(VDD) U3.187(VDD) U3.208(VDD)
VBAT: D18.1(A)
VCC_3V_RF: M23.2
VCC_5V_RF: C?#1.1 U?#1.1(Vin)
VDDA: CP44.1 CP44E.1 RFC3.2 U3.44(VDDA)
VREF+: CP43.2 CP43E.1 M?.1 U3.43(VREF+)
CLK_25Mhz: U?#2.3(OUT)
NRST: R32.2 U3.37(NRST) ; port NRST
SMPS_GND: CP19.2 CP20.1 CP21.1 CP154.1 CP199.1 M21.1 U3.18(VSSSMPS)
SMPS_VDD: CP21.2 CP154.2 CP199.2 L1.2 U3.21(VFBSMPS) U3.89(VCAP) U3.91(VDDLDO) U3.152(VCAP) U3.154(VDDLDO) U3.199(VCAP) U3.202(VDDLDO)
NetBOOT0_1: BOOT0.1 R34.2 U3.194(BOOT0)
NetC39_1: C39.1 U3.11(PC14-OSC32_IN) Y1.1(X1)
NetC40_2: C40.2 U3.12(PC15-OSC32_OUT) Y1.4(X2)
NetC?#2_2: C?#2.2 RFC?.1 U?#2.4(VCC)
NetCP19_1: CP19.1 L1.1 U3.19(VLXSMPS)
NetCP20_2: CP20.2 RFC2.2 U3.20(VDDSMPS)
NetCP119_1: CP119.1 CP119E.1 U3.119(VCAPDSI) U3.120(VDD12DSI) U3.126(VDD12DSI)
NetCP140_1: CP140.1 M22.1 U3.140(VDD50USB) U3.141(VDD33USB)
NetD17_2: D17.2(K) D18.2(K) U3.8(VBAT)
NetM?_2: M?.2 U?#1.2(Vout)
NetR33_2: R33.2 U3.201(PDR_ON)
NetU3_35: U3.35(PH0-OSC_IN) ; port CLK_25Mhz

Not connected (* = marked no-connect by the designer): U?#2 1(NC)*; Y1 2(NC) 3(NC)

### Layout directives
rule Width Constraint [Pref Width = 12mil    Min Width = 12mil    Max Width = 12mil]: NetC?#2_2, NetCP19_1, NetCP20_2, NetCP119_1, SMPS_GND, SMPS_VDD, UI_3V_MCU, VDDA
rule Width Constraint [Pref Width = 20mil    Min Width = 20mil    Max Width = 20mil]: VCC_3V_RF

### Notes on the sheet
- (near U?#1) Close to U50
- (near R32) To enter bootrom , use BOOT0 TP, no BOOT1 on this chip, only fuses
- (near CP21) Place near L3
- 1.2V
- (near C39) 1.5pF, NPO,250V, FN 756-8401
- (near Y1) FN 283-2029
- (near C40) 1.5pF, NPO,250V, FN 756-8401
- (near U?#2) Thermally isolated
- 1.15 to 1.3 V: optional supply voltage
- for the DSI PHY (DSI regulator off)
- DSI regulator supply output
- Ceramic capacitor (Low ESR <600m ohm)
- Current control bypass
- (near M23) 160mA idle/200mA peak (DSI refresh)
- Only one 2.2uF required on board
- Huge pulsing on the CPU rail, maybe big cap, 220 uF, or two ?
- 6
- CPU power and clock
- Date:
- File:
- Revision:
- Sheet
- of
- License:

### Library data of the parts
BOOT0 = TP: Test point
C39 = CAP: Capacitor; Order: FN 756-8401; QT Order: QCC-00266; QT Price: 0.045; Price: 0.341
C40 = CAP: Capacitor; Order: FN 756-8401; QT Order: QCC-00266; Price: 0.341
C41 = CAP-POL: Electrolitic capacitor; Notes: Tantalum capacitor; Price: 0.235
C?#1 = CAP: as C20 on sheet logic_conn; Price: 0.068
C?#2 = CAP: Capacitor; Order: FN 174-0673; QT Order: QCC-00154; Price: 0.068
CP7 CP17 CP29 CP44 CP49 CP56 CP74 CP80 CP100 CP108 CP114 CP117 CP133 CP155 CP161 CP179 CP187 CP208 = CAP: as CR1 on sheet logic_sdram; Price: 0.089
CP19 CP43 CP199 = Cap: Capacitor; Value: 10nF; Published: 8-Jun-2000; Revision: July-2002: Re-released for DXP Platform.; Publisher: Altium Limited
CP20 = Cap: Ceramic Capacitor; Published: 8-Jun-2000; Revision: July-2002: Re-released for DXP Platform.; Publisher: Altium Limited; Notes: Ceramic Capacitor
CP21 = Cap: Ceramic Capacitor; Value: 10nF; Published: 8-Jun-2000; Revision: July-2002: Re-released for DXP Platform.; Publisher: Altium Limited; Notes: Ceramic Capacitor
CP43E = Cap Pol1: Value: 10uF; Published: 8-Jun-2000; Revision: July-2002: Re-released for DXP Platform.; Publisher: Altium Limited
CP44E = CAP-POL: Electrolitic capacitor; Order: FN 145-7406; QT Order: QCC-00172; Price: 0.235
CP119 = CAP: Capacitor; Published: 8-Jun-2000; Revision: July-2002: Re-released for DXP Platform.; Publisher: Altium Limited; Value: 100nF
CP119E = CAP: Capacitor; Value: 100nF; Published: 8-Jun-2000; Revision: July-2002: Re-released for DXP Platform.; Publisher: Altium Limited
CP140 = CAP SMD 0603  X5R 1礔 25V 10%: 0603  X5R 1礔; Rated voltage: 25V; Tolerance: 10%; Manufacturer: *; Manufacturer P/N: *; Order code Farnell: 1288202RL; Value: 1礔; Power: *; Technology: X5R; Temperature  Factor: *; Temperature Max: +125癈; Temperature Min: -55癈; STS Code: *
CP154 = cap: Capacitor; Value: 100nF; Ordered by: Subcon; ECCN_US/EU: NA; Fitted: NO; Notes: Ceramic capacitor, low ESR; Published: 8-Jun-2000; Revision: July-2002: Re-released for DXP Platform.; Publisher: Altium Limited
D17 D18 = PMEG6010CEH: as D1 on sheet logic_conn; Price: 0.085
L1 = Inductor: Power Inductor; Notes: maybe LQM2MPN2R2NG0? We already ordered this for the BMS test board, should have a code; Published: 8-Jun-2000; Revision: July-2002: Re-released for DXP Platform.; Publisher: Altium Limited
M21-M23 M? = RES: as M43 on sheet logic_sdram; Price: 0.009
R32-R34 = RES: Resistor; Order: FN 146-9857; Price: 0.046
RFC2 RFC3 = Inductor: Value: 100uH; Published: 8-Jun-2000; Revision: July-2002: Re-released for DXP Platform.; Publisher: Altium Limited
RFC? = Inductor: Order: FN 166-9895; Price: 0.16
U3 = STM32H747BIT6: STM32H747BIT6 LQFP208; Order: FN 248-4976; Price: 10.97
U?#1 = NCP51460: 3.3V voltage reference, SOT-23
U?#2 = FOX924B-16.000: TCXO; Order: FN 206-3959; Price: 2.77
Y1 = SmdCrystal: 32kHz Crystal; Order: FN 283-2029; Price: 0.34

## Nets that join several sheets
GND: logic_conn (37 pins), logic_sdram (24 pins), logic_cpu_power (56 pins)
UI_3V_MCU: logic_conn (D3.2 D4.2), logic_cpu_power (42 pins)
VBAT: logic_conn (D1000.2 D1001.2), logic_cpu_power (D18.1)
VCC_3V_RF: logic_conn (C37.2 J2.4), logic_sdram (M43.1), logic_cpu_power (M23.2)
VCC_5V_RF: logic_conn (C38.2 J2.5), logic_cpu_power (C?#1.1 U?#1.1)
VREF+: logic_conn (J1.30), logic_cpu_power (CP43.2 CP43E.1 M?.1 U3.43)